# Altium schematic sheet 人机交互.SchDoc: 人机交互
size A4; Organization: Altium Limited; Address1: L3, 12a Rodborough Rd; Address2: Frenchs Forest; Address3: NSW; Address4: Australia 2086; DocumentNumber: 6; Revision: V1.0; SheetNumber: 6; SheetTotal: 6; Designer: 樊浩柏
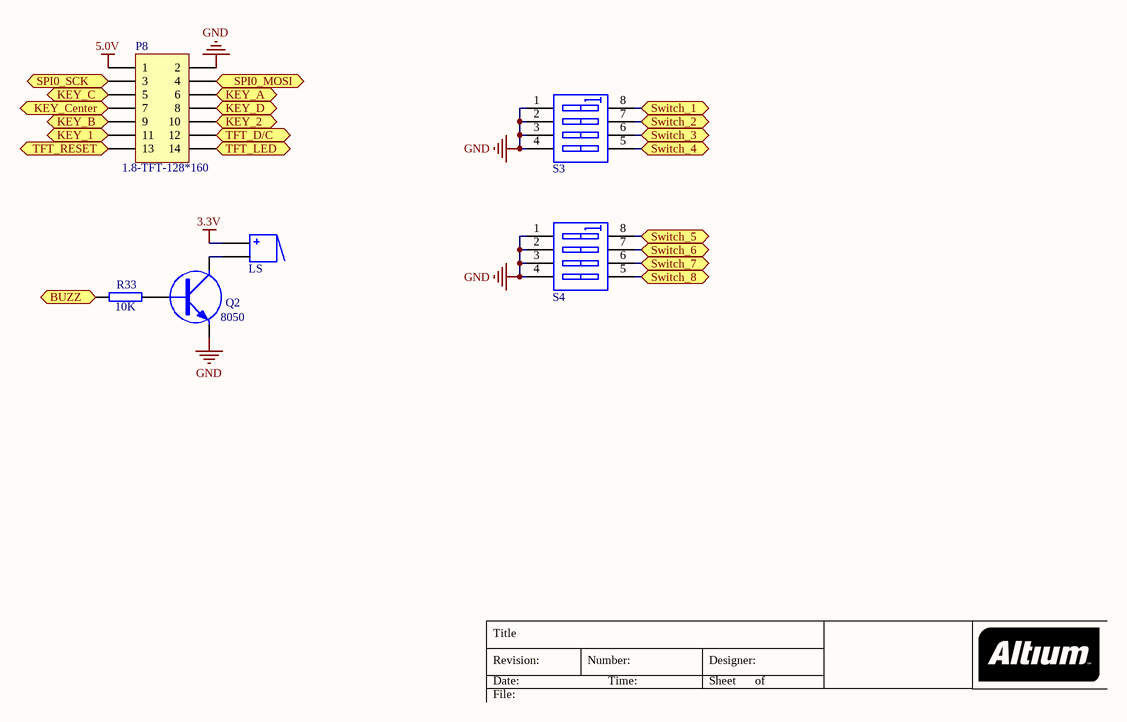
[diagram p0: 人机交互.SchDoc]

## Parts
LS  Buzzer  [BUZZER_9.5*6MM]  (value not drawn)
P8  1.8-TFT-128*160  [Female-Header-2.00-Double-14]
Q2  8050  [SOT-23-3]
R33  10K  [RES-0603]
S3  Switch  [SW-Piano-DIP-4]  (value not drawn)
S4  Switch  [SW-Piano-DIP-4]  (value not drawn)

## Ports
BUZZ, KEY_1, KEY_2, KEY_A, KEY_B, KEY_C, KEY_Center, KEY_D, SPI0_MOSI, SPI0_SCK, Switch_1, Switch_2, Switch_3, Switch_4, Switch_5, Switch_6, Switch_7, Switch_8, TFT_D/C, TFT_LED, TFT_RESET

## Nets
3.3V: LS.A
5.0V: P8.1
GND: P8.2 Q2.2(E) S3.1(A1) S3.2(A2) S3.3(A3) S3.4(A4) S4.1(A1) S4.2(A2) S4.3(A3) S4.4(A4)
BUZZ: R33.1 ; port BUZZ
KEY_1: P8.11 ; port KEY_1
KEY_2: P8.10 ; port KEY_2
KEY_A: P8.6 ; port KEY_A
KEY_B: P8.9 ; port KEY_B
KEY_C: P8.5 ; port KEY_C
KEY_Center: P8.7 ; port KEY_Center
KEY_D: P8.8 ; port KEY_D
SPI0_MOSI: P8.4 ; port SPI0_MOSI
SPI0_SCK: P8.3 ; port SPI0_SCK
Switch_1: S3.8(B1) ; port Switch_1
Switch_2: S3.7(B2) ; port Switch_2
Switch_3: S3.6(B3) ; port Switch_3
Switch_4: S3.5(B4) ; port Switch_4
Switch_5: S4.8(B1) ; port Switch_5
Switch_6: S4.7(B2) ; port Switch_6
Switch_7: S4.6(B3) ; port Switch_7
Switch_8: S4.5(B4) ; port Switch_8
TFT_D/C: P8.12 ; port TFT_D/C
TFT_LED: P8.14 ; port TFT_LED
TFT_RESET: P8.13 ; port TFT_RESET
NetLS_K: LS.K Q2.3(C)
NetQ2_1: Q2.1(B) R33.2

## Notes on the sheet
- Title
- Revision:
- Date:
- Number:
- Time:
- Designer:
- Sheet
- of
- File:

## Library data of the parts
P8 = CON-7X2
Q2 = NPN
R33 = Res
S3 S4 = Switch-DIP-4